# EAGLE design T41 (EAGLE 9.6.2)
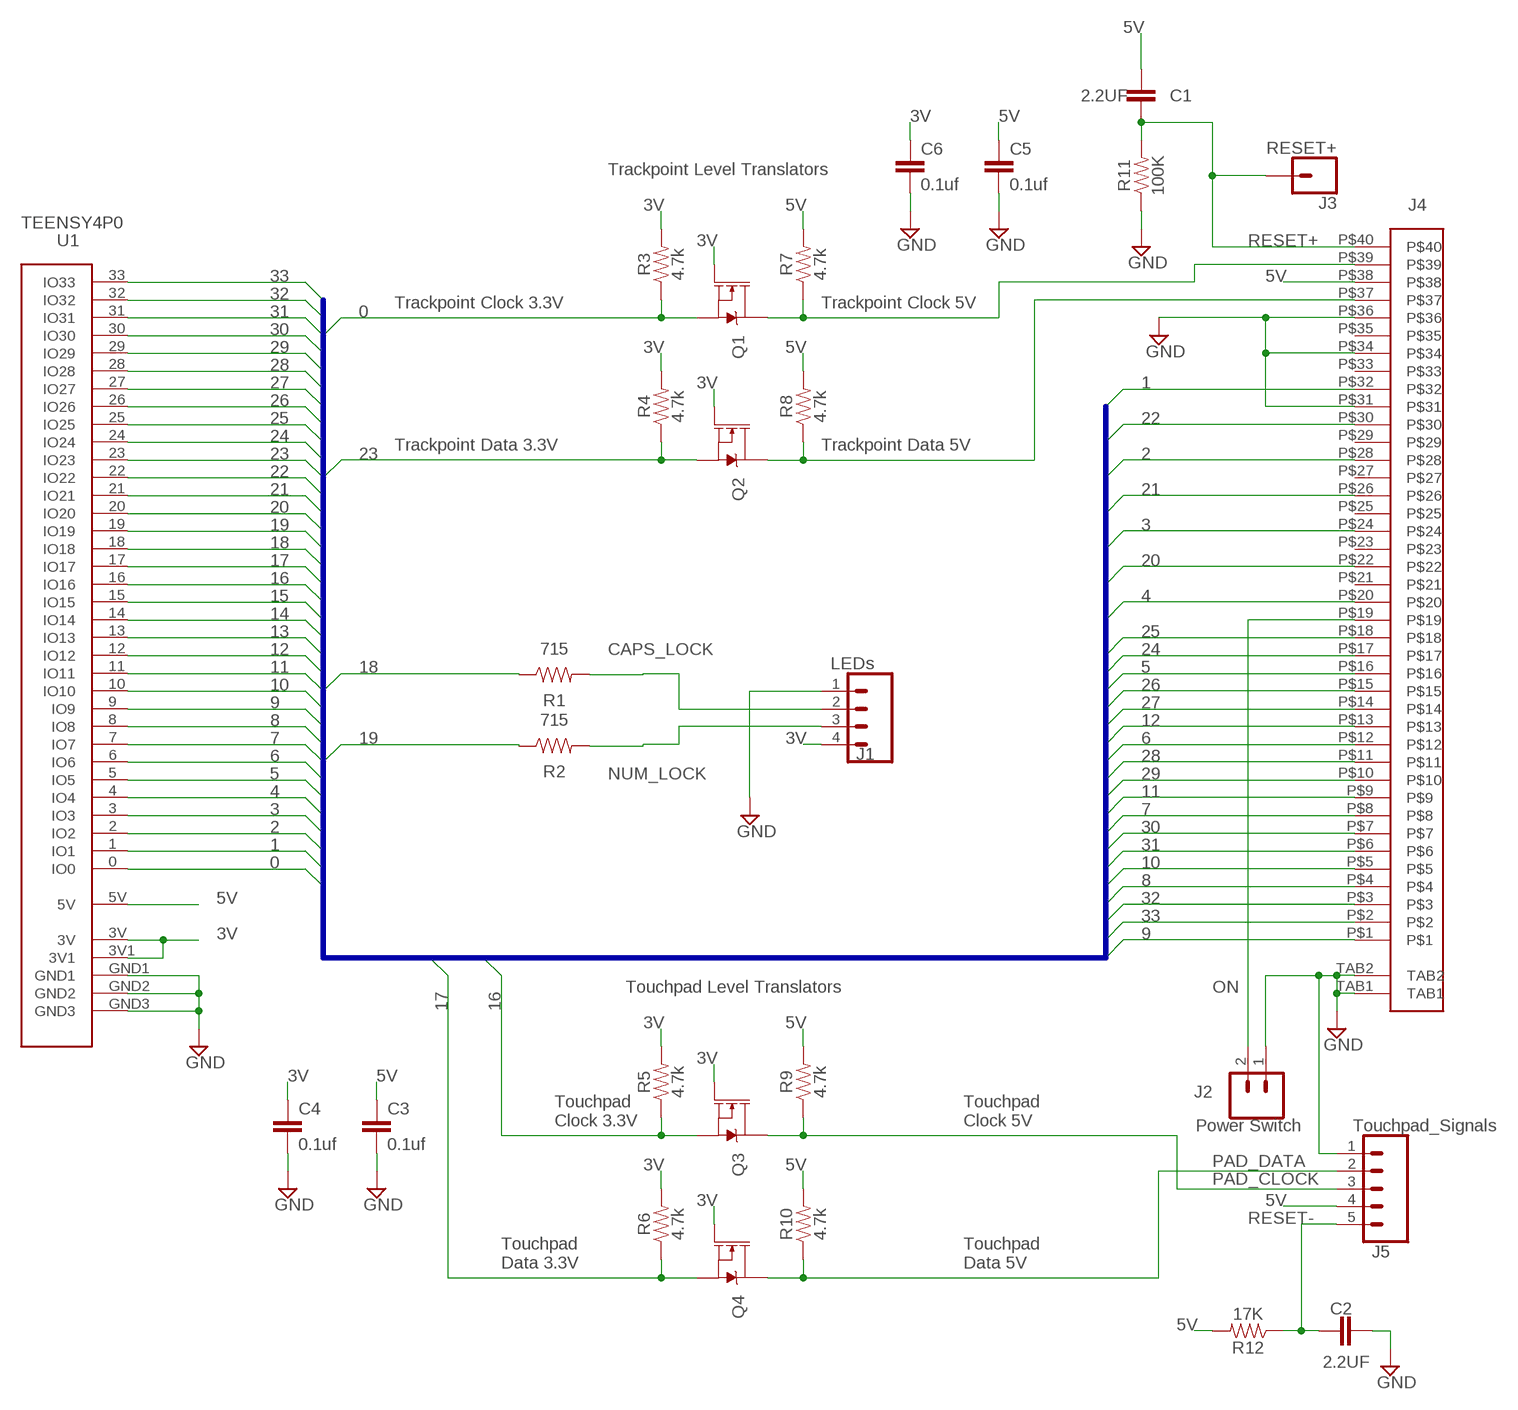
[diagram p0: schematic, sheet 1]

## Parts
C1  2.2UF  0603_CAP  [0603_CAP]
C2  2.2UF  0603_CAP  [0603_CAP]
C3  0.1uf  0603_CAP  [0603_CAP]
C4  0.1uf  0603_CAP  [0603_CAP]
C5  0.1uf  0603_CAP  [0603_CAP]
C6  0.1uf  0603_CAP  [0603_CAP]
J1  LEDs  CONN_04  [1X04]
J2  Power Switch  CONN_02  [1X02]
J3  RESET+  CONN_01PTH_NO_SILK_YES_STOP  [1X01_NO_SILK]
J4  KX14-40K5DE  KX14_40K5DE  [KX14_40K5DE]
J5  Touchpad_Signals  CONN_05  [1X05]
Q1  220mA/50V/3.5Ω  MOSFET-NCH-BSS138  [SOT23-3]
Q2  220mA/50V/3.5Ω  MOSFET-NCH-BSS138  [SOT23-3]
Q3  220mA/50V/3.5Ω  MOSFET-NCH-BSS138  [SOT23-3]
Q4  220mA/50V/3.5Ω  MOSFET-NCH-BSS138  [SOT23-3]
R1  715  715OHM-0603-1/10W-1%  [0603]
R2  715  715OHM-0603-1/10W-1%  [0603]
R3  4.7k  4.7KOHM-0603-1/10W-1%  [0603]
R4  4.7k  4.7KOHM-0603-1/10W-1%  [0603]
R5  4.7k  4.7KOHM-0603-1/10W-1%  [0603]
R6  4.7k  4.7KOHM-0603-1/10W-1%  [0603]
R7  4.7k  4.7KOHM-0603-1/10W-1%  [0603]
R8  4.7k  4.7KOHM-0603-1/10W-1%  [0603]
R9  4.7k  4.7KOHM-0603-1/10W-1%  [0603]
R10  4.7k  4.7KOHM-0603-1/10W-1%  [0603]
R11  100K  0603_RESISTOR  [0603_RESISTOR]
R12  17K  0603_RESISTOR  [0603_RESISTOR]
U1  TEENSY4P0  [TEENSY4P0]

## Nets
0: Q1.2(S) R3.1 U1.0(IO0)
1: J4.P$32 U1.1(IO1)
2: J4.P$28 U1.2(IO2)
3: J4.P$24 U1.3(IO3)
3V: C4.1 C6.1 J1.4 Q1.1(G) Q2.1(G) Q3.1(G) Q4.1(G) R3.2 R4.2 R5.2 R6.2 U1.3V U1.3V1
4: J4.P$20 U1.4(IO4)
5: J4.P$16 U1.5(IO5)
5V: C1.1 C3.1 C5.1 J4.P$38 J5.4 R7.2 R8.2 R9.2 R10.2 R12.2 U1.5V
6: J4.P$12 U1.6(IO6)
7: J4.P$8 U1.7(IO7)
8: J4.P$4 U1.8(IO8)
9: J4.P$1 U1.9(IO9)
10: J4.P$5 U1.10(IO10)
11: J4.P$9 U1.11(IO11)
12: J4.P$13 U1.12(IO12)
13: U1.13(IO13)
14: U1.14(IO14)
15: U1.15(IO15)
16: Q3.2(S) R5.1 U1.16(IO16)
17: Q4.2(S) R6.1 U1.17(IO17)
18: R1.1 U1.18(IO18)
19: R2.1 U1.19(IO19)
20: J4.P$22 U1.20(IO20)
21: J4.P$26 U1.21(IO21)
22: J4.P$30 U1.22(IO22)
23: Q2.2(S) R4.1 U1.23(IO23)
24: J4.P$17 U1.24(IO24)
25: J4.P$18 U1.25(IO25)
26: J4.P$15 U1.26(IO26)
27: J4.P$14 U1.27(IO27)
28: J4.P$11 U1.28(IO28)
29: J4.P$10 U1.29(IO29)
30: J4.P$7 U1.30(IO30)
31: J4.P$6 U1.31(IO31)
32: J4.P$3 U1.32(IO32)
33: J4.P$2 U1.33(IO33)
CAPS_LOCK: J1.2 R1.2
GND: C2.2 C3.2 C4.2 C5.2 C6.2 J1.1 J2.1 J4.P$31 J4.P$34 J4.P$36 J4.TAB1 J4.TAB2 J5.1 R11.1 U1.GND1 U1.GND2 U1.GND3
NUM_LOCK: J1.3 R2.2
ON: J2.2 J4.P$19
PAD_CLOCK: J5.3 Q3.3(D) R9.1
PAD_DATA: J5.2 Q4.3(D) R10.1
RESET+: C1.2 J3.1 J4.P$40 R11.2
RESET-: C2.1 J5.5 R12.1
TP_CLK: J4.P$39 Q1.3(D) R7.1
TP_DATA: J4.P$37 Q2.3(D) R8.1
Unconnected: J4.P$21 J4.P$23 J4.P$25 J4.P$27 J4.P$29 J4.P$33 J4.P$35

## Buses
IO:0,1,2,3,4,5,6,7,8,9,10,11,12,13,14,15,16,17,18,19,20,21,22,23,24,25,26,27,28,29,30,31,32,33,TPCLK,TPDATA

## Notes on the sheet
- Trackpoint Level Translators
- J4
- Trackpoint Clock 3.3V | Trackpoint Clock 5V
- Trackpoint Data 3.3V | Trackpoint Data 5V
- Touchpad Level Translators
- Touchpad
  Clock 3.3V
- Touchpad
  Clock 5V
- Touchpad
  Data 3.3V
- Touchpad
  Data 5V

## Library data of the parts
C1-C6 = 0603_CAP:0603_CAP
J1 = SparkFun-Connectors:CONN_04: Multi connection point. Often used as Generic Header-pin footprint for 0.1 inch spaced/style header connections On any of the 0.1 inch spaced packages, you can populate with these: Break Away Headers - Straight <https://www.sparkfun.com/products/116> (PRT-00116) Break Away Male Headers - Right Angle <https://www.sparkfun.com/products/553> (PRT-00553) Female Headers <https://www.sparkfun.com/products/115> (PRT-00115) Break Away Headers - Machine Pin <https://www.sparkfun.com/products/117> (PRT-00117) Break Away Female Headers - Swiss Machine Pin <https://www.sparkfun.com/products/743> (PRT-00743) For SCREWTERMINALS and SPRING TERMINALS visit here: Screw Terimnals on SparkFun.com <https://www.sparkfun.com/search/results?term=Screw+Terminals> (5mm/3.5mm/2.54mm spacing) This device is also useful as a general connection point to wire up your design to another part of your project. Our various solder wires solder well into these plated through hole pads. Hook-Up Wire - Assortment (Stranded, 22 AWG) <https://www.sparkfun.com/products/11375> (PRT-11375) Hook-Up Wire - Assortment (Solid Core, 22 AWG) <https://www.sparkfun.com/products/11367> (PRT-11367) View the entire wire category on our website here <https://www.sparkfun.com/categories/141> Special notes: Molex polarized connector foot print use with SKU : PRT-08231 with associated crimp pins and housings. 1MM SMD Version SKU: PRT-10208; PROD_ID: CONN-09696
J2 = SparkFun-Connectors:CONN_02: Multi connection point. Often used as Generic Header-pin footprint for 0.1 inch spaced/style header connections On any of the 0.1 inch spaced packages, you can populate with these: Break Away Headers - Straight <https://www.sparkfun.com/products/116> (PRT-00116) Break Away Male Headers - Right Angle <https://www.sparkfun.com/products/553> (PRT-00553) Female Headers <https://www.sparkfun.com/products/115> (PRT-00115) Break Away Headers - Machine Pin <https://www.sparkfun.com/products/117> (PRT-00117) Break Away Female Headers - Swiss Machine Pin <https://www.sparkfun.com/products/743> (PRT-00743) For SCREWTERMINALS and SPRING TERMINALS visit here: Screw Terimnals on SparkFun.com <https://www.sparkfun.com/search/results?term=Screw+Terminals> (5mm/3.5mm/2.54mm spacing) This device is also useful as a general connection point to wire up your design to another part of your project. Our various solder wires solder well into these plated through hole pads. Hook-Up Wire - Assortment (Stranded, 22 AWG) <https://www.sparkfun.com/products/11375> (PRT-11375) Hook-Up Wire - Assortment (Solid Core, 22 AWG) <https://www.sparkfun.com/products/11367> (PRT-11367) View the entire wire category on our website here <https://www.sparkfun.com/categories/141> Special notes: Molex polarized connector foot print use with: PRT-08233 with associated crimp pins and housings. 2.54_SCREWTERM for use with PRT-10571. 3.5mm Screw Terminal footprints for PRT-08084 5mm Screw Terminal footprints for use with PRT-08432
J3 = SparkFun-Connectors:CONN_01: Single connection point. Often used as Generic Header-pin footprint for 0.1 inch spaced/style header connections On any of the 0.1 inch spaced packages, you can populate with these: Break Away Headers - Straight <https://www.sparkfun.com/products/116> (PRT-00116) Break Away Male Headers - Right Angle <https://www.sparkfun.com/products/553> (PRT-00553) Female Headers <https://www.sparkfun.com/products/115> (PRT-00115) Break Away Headers - Machine Pin <https://www.sparkfun.com/products/117> (PRT-00117) Break Away Female Headers - Swiss Machine Pin <https://www.sparkfun.com/products/743> (PRT-00743) This device is also useful as a general connection point to wire up your design to another part of your project. Our various solder wires solder well into these plated through hole pads. Hook-Up Wire - Assortment (Stranded, 22 AWG) <https://www.sparkfun.com/products/11375> (PRT-11375) Hook-Up Wire - Assortment (Solid Core, 22 AWG) <https://www.sparkfun.com/products/11367> (PRT-11367) View the entire wire category on our website here <https://www.sparkfun.com/categories/141> Special notes: SMTSO-256-ET is a "flush mount" nut for a 4-40 screw. We mostly use this on specialty testbeds; it is a nice way to connect hardware to your PCB at an adjustable hieght. Also note, the SNAP packages are for using a snappable style connector. We sell a baggie of snaps and they are also used on two LilyPad designs: Snap Assortment - 30 pack (male and female) <https://www.sparkfun.com/products/11347> (DEV-11347) LilyPad Arduino SimpleSnap <https://www.sparkfun.com/products/10941> (DEV-10941) LilyPad SimpleSnap Protoboard <https://www.sparkfun.com/products/10940> (DEV-10940)
J4 = KX14_40K5DE:KX14_40K5DE
J5 = SparkFun-Connectors:CONN_05: Multi connection point. Often used as Generic Header-pin footprint for 0.1 inch spaced/style header connections On any of the 0.1 inch spaced packages, you can populate with these: Break Away Headers - Straight <https://www.sparkfun.com/products/116> (PRT-00116) Break Away Male Headers - Right Angle <https://www.sparkfun.com/products/553> (PRT-00553) Female Headers <https://www.sparkfun.com/products/115> (PRT-00115) Break Away Headers - Machine Pin <https://www.sparkfun.com/products/117> (PRT-00117) Break Away Female Headers - Swiss Machine Pin <https://www.sparkfun.com/products/743> (PRT-00743) For SCREWTERMINALS and SPRING TERMINALS visit here: Screw Terimnals on SparkFun.com <https://www.sparkfun.com/search/results?term=Screw+Terminals> (5mm/3.5mm/2.54mm spacing) This device is also useful as a general connection point to wire up your design to another part of your project. Our various solder wires solder well into these plated through hole pads. Hook-Up Wire - Assortment (Stranded, 22 AWG) <https://www.sparkfun.com/products/11375> (PRT-11375) Hook-Up Wire - Assortment (Solid Core, 22 AWG) <https://www.sparkfun.com/products/11367> (PRT-11367) View the entire wire category on our website here <https://www.sparkfun.com/categories/141> Special notes: Molex polarized connector foot print use with SKU : PRT-08231 with associated crimp pins and housings. 1MM SMD Version SKU: PRT-10208
Q1-Q4 = SparkFun-DiscreteSemi:MOSFET-NCH: N-channel MOSFETs Voltage controlled devices that allow control of high current outputs. SparkFun Products: SparkFun OpenScale <https://www.sparkfun.com/products/13261> SparkFun Digital Sandbox <https://www.sparkfun.com/products/12651> SparkFun Monster Moto Shield <https://www.sparkfun.com/products/10182> SparkFun MOSFET Power Controller <https://www.sparkfun.com/products/11214>; PROD_ID: TRANS-00830
R1 R2 = SparkFun-Resistors:715OHM: 715Ω resistor A resistor is a passive two-terminal electrical component that implements electrical resistance as a circuit element. Resistors act to reduce current flow, and, at the same time, act to lower voltage levels within circuits. - Wikipedia; PROD_ID: RES-07850
R3-R10 = SparkFun-Resistors:4.7KOHM: 4.7kΩ resistor A resistor is a passive two-terminal electrical component that implements electrical resistance as a circuit element. Resistors act to reduce current flow, and, at the same time, act to lower voltage levels within circuits. - Wikipedia; PROD_ID: RES-07857
R11 R12 = 0603_RESISTOR:0603_RESISTOR
U1 = TEENSY4P0:TEENSY4P0

## Board
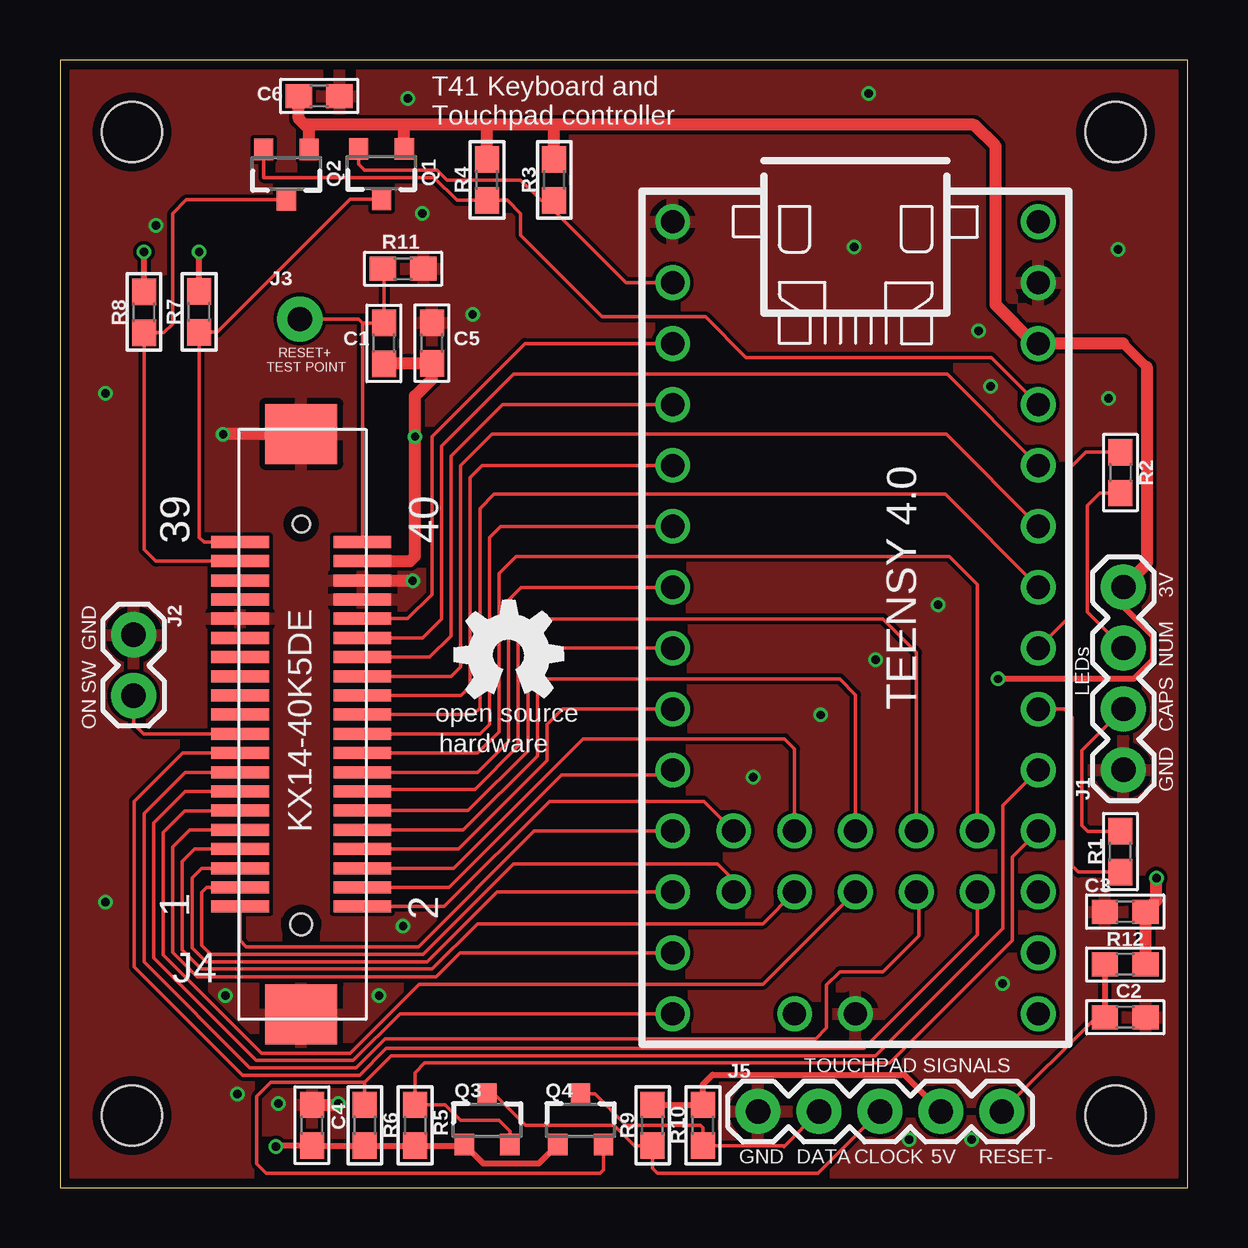
[diagram p1: board, top side]
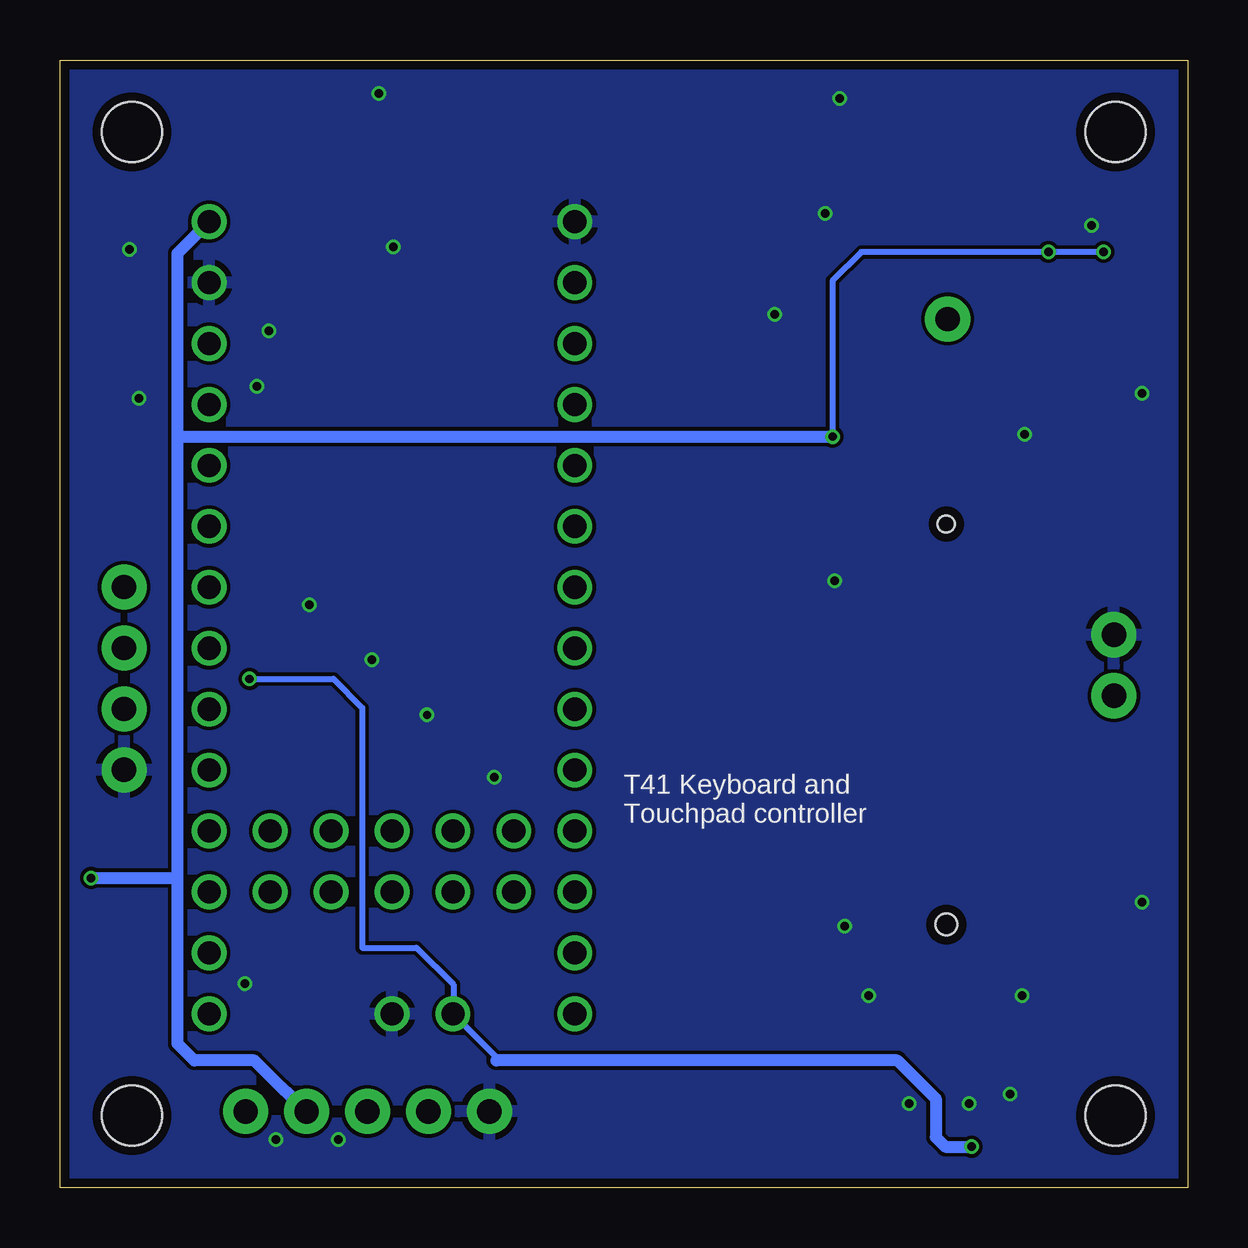
[diagram p2: board, bottom side, seen from below]

Size 47 x 47 mm. Coordinates in mm from the lower left corner, seen from the top.
Outline: 0,0 47,0 47,47 0,47 0,0
Copper layers (1*16): Top 0.035559375mm / dielectric 1.6mm / Bottom 0.035559375mm
Design rules "oshpark-2layer": minimum track width 6mil, minimum drill 10mil, track to track 6mil, track to pad 6mil, pad to pad 6mil, via to via 6mil, smd to smd 6mil, copper to edge 15mil, drill to drill 6mil, minimum pad ring 5mil, minimum via ring 5mil, stop-mask expansion 2.5mil, vias tented up to drill 0mil, thermal gap 10mil
Holes 2.5 mm at 3,44 44,44 3,3 44,3

### Footprints (pad centres in the part's own frame; a part is rotated, then mirrored left to right if it is on the bottom)
0603_CAP = smd 1.1 x 1: 1 -0.85,0; 2 0.85,0
1X04 = drill 1.016 pad 1.88: 1 0,0; 2 2.54,0; 3 5.08,0; 4 7.62,0
1X02 = drill 1.016 pad 1.88: 1 0,0; 2 2.54,0
1X01_NO_SILK = drill 1.016 pad 1.88: 1 0,0
KX14_40K5DE = smd 0.5 x 2.4: P$1 0,2.55; P$2 0,-2.55; P$3 0.8,2.55; P$4 0.8,-2.55; P$5 1.6,2.55; P$6 1.6,-2.55; P$7 2.4,2.55; P$8 2.4,-2.55; P$9 3.2,2.55; P$10 3.2,-2.55; P$11 4,2.55; P$12 4,-2.55; P$13 4.8,2.55; P$14 4.8,-2.55; P$15 5.6,2.55; P$16 5.6,-2.55; P$17 6.4,2.55; P$18 6.4,-2.55; P$19 7.2,2.55; P$20 7.2,-2.55; P$21 8,2.55; P$22 8,-2.55; P$23 8.8,2.55; P$24 8.8,-2.55; P$25 9.6,2.55; P$26 9.6,-2.55; P$27 10.4,2.55; P$28 10.4,-2.55; P$29 11.2,2.55; P$30 11.2,-2.55; P$31 12,2.55; P$32 12,-2.55; P$33 12.8,2.55; P$34 12.8,-2.55; P$35 13.6,2.55; P$36 13.6,-2.55; P$37 14.4,2.55; P$38 14.4,-2.55; P$39 15.2,2.55; P$40 15.2,-2.55 | smd 2.5 x 3: TAB1 -4.5,0; TAB2 19.7,0 | hole 0.9: -0.75,0 | hole 0.7: 15.95,0
1X05 = drill 1.016 pad 1.88: 1 0,0; 2 2.54,0; 3 5.08,0; 4 7.62,0; 5 10.16,0
SOT23-3 = smd 0.8 x 0.9: 1 -0.95,-1; 2 0.95,-1; 3 0,1.1
0603 = smd 1.1 x 1: 1 -0.85,0; 2 0.85,0
0603_RESISTOR = smd 1.1 x 1: 1 -0.85,0; 2 0.85,0
TEENSY4P0 = drill 0.965: 0 -12.7,-7.62; 1 -10.16,-7.62; 2 -7.62,-7.62; 3 -5.08,-7.62; 3V -10.16,7.62; 3V1 17.78,-2.54; 4 -2.54,-7.62; 5 0,-7.62; 5V -15.24,7.62; 6 2.54,-7.62; 7 5.08,-7.62; 8 7.62,-7.62; 9 10.16,-7.62; 10 12.7,-7.62; 11 15.24,-7.62; 12 17.78,-7.62; 13 17.78,7.62; 14 15.24,7.62; 15 12.7,7.62; 16 10.16,7.62; 17 7.62,7.62; 18 5.08,7.62; 19 2.54,7.62; 20 0,7.62; 21 -2.54,7.62; 22 -5.08,7.62; 23 -7.62,7.62; 24 12.7,5.08; 25 10.16,5.08; 26 12.7,2.54; 27 10.16,2.54; 28 12.7,0; 29 10.16,0; 30 12.7,-2.54; 31 10.16,-2.54; 32 12.7,-5.08; 33 10.16,-5.08; GND1 -15.24,-7.62; GND2 -12.7,7.62; GND3 17.78,0

### Placement (x,y rotation side)
C1  13.5,35.19 90 top
C2  44.4,7.1 0 top
C3  44.4,11.5 180 top
C4  10.5,2.6 90 top
C5  15.5,35.2 90 top
C6  10.8,45.5 0 top
J1  44.33,17.41 90 top
J2  3.07,23.04 270 top
J3  10,36.2 0 top
J4  10.06,11.71 90 top
J5  29.1,3.17 0 top
Q1  13.4,42.3 180 top
Q2  9.44,42.27 180 top
Q3  17.8,2.8 0 top
Q4  21.7,2.8 0 top
R1  44.2,14 90 top
R2  44.2,29.8 270 top
R3  20.6,42 90 top
R4  17.8,42 90 top
R5  14.8,2.6 270 top
R6  12.7,2.6 270 top
R7  5.8,36.5 90 top
R8  3.51,36.48 90 top
R9  24.7,2.6 90 top
R10  26.8,2.6 90 top
R11  14.3,38.3 180 top
R12  44.4,9.3 0 top
U1  33.16,25.02 270 top
U$1  [OSHW_5MM]  18.7,22.2 0 top

### Tracks (layer width: path | path; a pad name or v marks a point on that pad's centre or on a via)
0
  Top 0.152: Q1.2 12.45,42.65 12.7,42.41 15.73,42.41 16.13,42 19.2,42 20.05,41.15 R3.1 20.6,40.72 23.6,37.72 U1.0
1
  Top 0.152: J4.P$32 14.49,23.71 15.5,24.72 15.5,31.3 19.38,35.18 U1.1
2
  Top 0.152: U1.2 18.44,32.64 16.3,30.5 16.3,23 15.41,22.11 J4.P$28
3
  Top 0.152: U1.3 17.6,30.1 17.1,29.6 17.1,20.9 16.71,20.51 J4.P$24
3V  (via drill 0.35)
  Top 0.254: Q4.1 19.95,1 17.65,1 Q3.1 16.82,1.77 16.76,1.75 R5.2 R6.2 C4.1 9.05,1.75 v9,1.7 | J1.4 44.33,24.21 45.55,23 45.55,21.98 44.76,21.2 v39.1,21.2
  Top 0.406: 44.32,35.18 45.3,34.2
  Top 0.508: 44.32,35.18 U1.3V 40.62,35.18 39,36.8 39,43.4 38.1,44.3 20.6,44.3 | 45.3,34.2 45.3,26 J1.4 | 20.6,44.3 17.8,44.3 | 17.8,44.3 14.4,44.3 | 14.4,44.3 10.2,44.3 | 10.2,44.3 9.95,44.55 C6.1 | Q2.1 10.39,44.11 10.2,44.3 | Q1.1 14.35,44.25 14.4,44.3 | R4.2 17.8,44.3 | R3.2 20.6,44.3
  Bottom 0.254: v39.1,21.2 35.6,21.2 34.4,20 34.4,10 32.14,10 30.6,8.46 30.6,7.26 U1.3V1 28.82,5.44 28.82,5.3
  Bottom 0.508: v9,1.7 10.1,1.7 10.5,2.1 10.5,3.7 12.1,5.3 28.82,5.3
4
  Top 0.152: U1.4 18.36,27.56 17.9,27.1 17.9,19.3 17.51,18.91 J4.P$20
5
  Top 0.152: U1.5 19.22,25.02 18.7,24.5 18.7,18.6 17.41,17.31 J4.P$16
5V  (via drill 0.35)
  Top 0.254: R8.2 v3.5,39 | R7.2 v5.8,39 | R9.2 R10.2 26.8,4.3 27.2,4.7 35.1,4.7 35.19,4.7 J5.4 | C1.1
  Top 0.508: J4.P$38 14.59,26.11 14.8,26.32 v14.8,31.3 14.8,33 15.5,33.7 C5.1 C1.1 | v45.7,12.9 45.7,11.95 C3.1 R12.2
  Bottom 0.254: v3.5,39 v5.8,39 13.6,39 14.8,37.8 v14.8,31.3
  Bottom 0.508: J5.4 37.76,4.16 38.9,5.3 41.4,5.3 42.1,6 42.1,12.9 | U1.5V 42.1,38.94 42.1,31.3 | 42.1,12.9 42.1,31.3 | v45.7,12.9 42.1,12.9 | 42.1,31.3 v14.8,31.3
6
  Top 0.152: U1.6 20.28,22.48 19.5,21.7 19.5,18.2 17.01,15.71 J4.P$12
7
  Top 0.152: U1.7 20.94,19.94 20.3,19.3 20.3,17.8 16.61,14.11 J4.P$8
8
  Top 0.152: U1.8 25.34,17.2 20.9,17.2 16.21,12.51 J4.P$4
9
  Top 0.152: J4.P$1 7.5,10.3 7.76,10.04 14.94,10.04 19.76,14.86 U1.9
10
  Top 0.152: J4.P$5 5.91,13.31 5.5,12.9 5.5,10 6.09,9.41 15.31,9.41 18.22,12.32 U1.10
11
  Top 0.152: J4.P$9 5.41,14.91 4.7,14.2 4.7,9.8 5.72,8.78 15.68,8.78 16.68,9.78 U1.11
12
  Top 0.152: J4.P$13 5.21,16.51 3.9,15.2 3.9,9.57 8.17,5.29 12.23,5.29 14.17,7.24 U1.12
16
  Top 0.152: U1.16 39.7,13.78 39.7,10.3 34.59,5.19 15.2,5.19 14.8,4.79 R5.1 16.05,3.45 16.7,2.8 18.3,2.8 18.75,2.35 Q3.2
17
  Top 0.152: U1.17 39.3,15.92 39.3,10.8 33.99,5.5 13.8,5.5 12.7,4.39 | Q4.2 22.65,0.75 22.5,0.6 8.6,0.6 8.2,1 8.2,3.8 8.78,4.38 12.61,4.38 12.63,4.39 12.7,4.39 | 12.7,4.39 R6.1
18
  Top 0.152: R1.1 43.3,13.15 43.24,13.15 42.45,13.15 42.4,13.2 42.2,13.4 42.2,19.6 41.86,19.94 U1.18
19
  Top 0.152: U1.19 42.1,23.8 42.1,30 42.75,30.65 R2.1
20
  Top 0.152: U1.20 36.9,28.9 18.1,28.9 17.5,28.3 17.5,20 17.21,19.71 J4.P$22
21
  Top 0.152: U1.21 36.94,31.4 18,31.4 16.7,30.1 16.7,21.7 16.31,21.31 J4.P$26
22
  Top 0.152: U1.22 36.98,33.9 18.9,33.9 15.9,30.9 15.9,23.7 15.11,22.91 J4.P$30
23
  Top 0.152: Q2.2 8.49,42.1 15.6,42.1 16.55,41.15 R4.1 18.65,41.15 19.2,40.6 19.2,39.7 22.6,36.3 26.9,36.3 28.6,34.6 38.82,34.6 U1.23
24
  Top 0.152: J4.P$17 5.11,18.11 3.1,16.1 3.1,9.2 7.61,4.69 12.49,4.69 13.6,5.8 33.5,5.8 38.24,10.54 U1.24
25
  Top 0.152: U1.25 38.24,25.14 37.08,26.3 19,26.3 18.3,25.6 18.3,19 17.41,18.11 J4.P$18
26
  Top 0.152: J4.P$15 5.21,17.31 3.5,15.6 3.5,9.4 7.91,4.99 12.35,4.99 13.56,6.2 31.5,6.2 31.95,6.65 31.95,8.45 32.5,9 34.3,9 35.8,10.5 35.8,12.22 U1.26
27
  Top 0.152: U1.27 35.7,22.3 34.3,23.7 19.7,23.7 19.1,23.1 19.1,18.4 17.3,16.6 12.7,16.6 J4.P$14
28
  Top 0.152: J4.P$11 5.2,15.7 4.3,14.8 4.3,9.7 8.4,5.6 12.1,5.6 14.97,8.47 29.31,8.47 U1.28
29
  Top 0.152: U1.29 33.16,20.54 32.5,21.2 20.3,21.2 19.9,20.8 19.9,18 16.81,14.91 J4.P$10
30
  Top 0.152: J4.P$7 5.61,14.11 5.1,13.6 5.1,9.9 5.89,9.11 15.51,9.11 17.4,11 29.3,11 U1.30
31
  Top 0.152: U1.31 30.62,18.28 30.2,18.7 21.8,18.7 16.41,13.31 J4.P$6
32
  Top 0.152: J4.P$3 6.11,12.51 5.9,12.3 5.9,10.1 6.28,9.72 15.12,9.72 18.9,13.5 27.4,13.5 28.08,12.82 U1.32
33
  Top 0.152: U1.33 26.84,16.1 20.4,16.1 16.01,11.71 J4.P$2
CAPS_LOCK
  Top 0.152: J1.2 42.6,18.22 42.6,15.1 42.85,14.85 R1.2
GND  (via drill 0.35)
  Top 0.508: C4.2 11.6,3.45 v11.6,3.5 | J4.P$36 v14.7,25.31 v14.7,25.3 | J4.TAB2 v6.8,31.41 v6.8,31.4
  other vias: 13.3,8 38,2 39.3,8.5 35.4,2 38.3,35.7 33.1,39.2 36.6,24.3 34,22 31.7,19.7 28.9,17.1 44.1,39.1 33.7,45.6 14.5,45.4 17.2,36.4 4,40.1 1.9,33.1 6.9,8 14.3,10.9 7.4,3.9 1.9,11.9 43.7,32.9 15.1,40.6 38.8,33.4 9.1,3.5
  pour Top: 0,0 0,47 47,47 47,0
  pour Bottom: 0,0 0,46.9 47,46.9 47,0
NUM_LOCK
  Top 0.152: J1.3 42.82,24 42.82,28.42 43.35,28.95 R2.2
ON
  Top 0.152: J4.P$19 3.49,18.91 3.07,19.33 J2.2
PAD_CLOCK
  Top 0.152: Q3.3 18.1,3.9 19.4,2.6 23.1,2.6 23.95,1.75 R9.1 24.7,0.8 24.9,0.6 31.6,0.6 J5.3
PAD_DATA
  Top 0.152: Q4.3 22.3,3.9 23.6,2.6 26.7,2.6 26.8,2.5 R10.1 30.19,1.75 30.18,1.71 J5.2
RESET+
  Top 0.152: 13.5,38.25 C1.2 12.62,36.04 12.61,36.03 | J4.P$40 12.61,36.03 | 12.61,36.03 12.44,36.2 J3.1
  Top 0.254: R11.2 13.5,38.25
RESET-
  Top 0.152: J5.5 43.19,7.1 C2.1
  Top 0.254: R12.1 C2.1
TP_CLK
  Top 0.152: J4.P$39 6.01,26.91 6,26.9 5.8,27.1 R7.1 6.55,35.65 12.1,41.2 Q1.3
TP_DATA
  Top 0.152: J4.P$37 3.99,26.11 3.5,26.6 R8.1 4.33,35.63 4.7,36 4.7,40.6 5.27,41.17 Q2.3

### Text on the board
tPlace: C6 | T41 Keyboard and / Touchpad controller | RESET+ | C1 | C5 | TEST POINT | 3V | GND | NUM | LEDs | ON SW | CAPS | GND | KX14-40K5DE | C3 | C2 | TOUCHPAD SIGNALS | C4 | GND | DATA | CLOCK | 5V | RESET-
bPlace: T41 Keyboard and / Touchpad controller